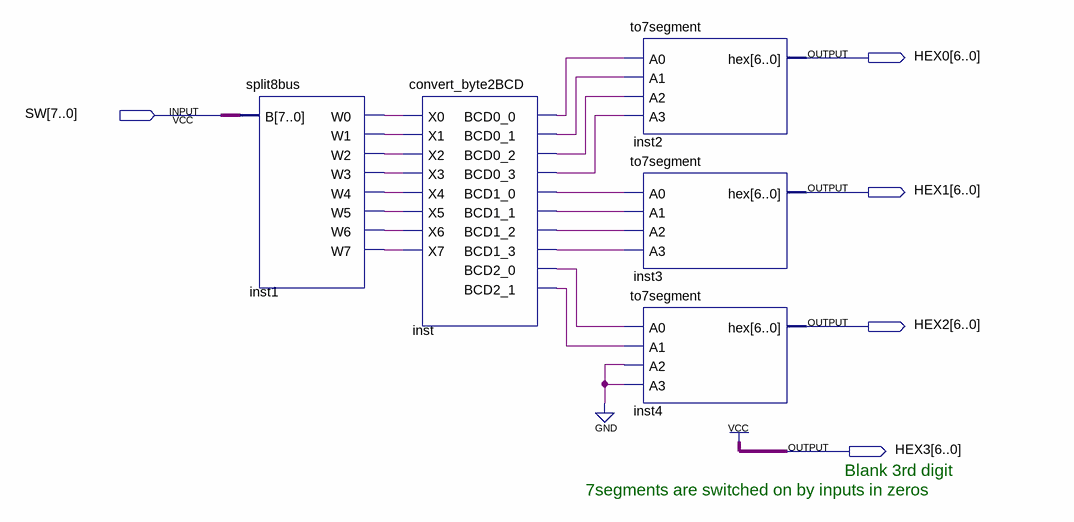
[diagram p0: schematic sheet]
// Quartus schematic test_convert_byte2bcd.bdf as structural Verilog: 5 symbols, 5 pins
module test_convert_byte2bcd (
  input  [7:0] SW,
  output [6:0] HEX0,
  output [6:0] HEX1,
  output [6:0] HEX2,
  output [6:0] HEX3
);

  wire inst1_w0, inst1_w1, inst1_w2, inst1_w3, inst1_w4, inst1_w5, inst1_w6, inst1_w7, inst_bcd0_0,
       inst_bcd0_1, inst_bcd0_2, inst_bcd0_3, inst_bcd1_0, inst_bcd1_1, inst_bcd1_2, inst_bcd1_3,
       inst_bcd2_0, inst_bcd2_1;

  split8bus inst1 (
    .B(SW), .W0(inst1_w0), .W1(inst1_w1), .W2(inst1_w2), .W3(inst1_w3), .W4(inst1_w4), .W5(inst1_w5),
    .W6(inst1_w6), .W7(inst1_w7));
  convert_byte2BCD inst (
    .X0(inst1_w0), .X1(inst1_w1), .X2(inst1_w2), .X3(inst1_w3), .X4(inst1_w4), .X5(inst1_w5), .X6(inst1_w6),
    .X7(inst1_w7), .BCD0_0(inst_bcd0_0), .BCD0_1(inst_bcd0_1), .BCD0_2(inst_bcd0_2), .BCD0_3(inst_bcd0_3),
    .BCD1_0(inst_bcd1_0), .BCD1_1(inst_bcd1_1), .BCD1_2(inst_bcd1_2), .BCD1_3(inst_bcd1_3),
    .BCD2_0(inst_bcd2_0), .BCD2_1(inst_bcd2_1));
  to7segment inst2 (.A0(inst_bcd0_0), .A1(inst_bcd0_1), .A2(inst_bcd0_2), .A3(inst_bcd0_3), .hex(HEX0));
  to7segment inst3 (.A0(inst_bcd1_0), .A1(inst_bcd1_1), .A2(inst_bcd1_2), .A3(inst_bcd1_3), .hex(HEX1));
  to7segment inst4 (.A0(inst_bcd2_0), .A1(inst_bcd2_1), .A2(1'b0), .A3(1'b0), .hex(HEX2));

  assign HEX3 = {7{1'b1}};

  // Notes on the sheet:
  //   Blank 3rd digit 
  //   7segments are switched on by inputs in zeros
endmodule
